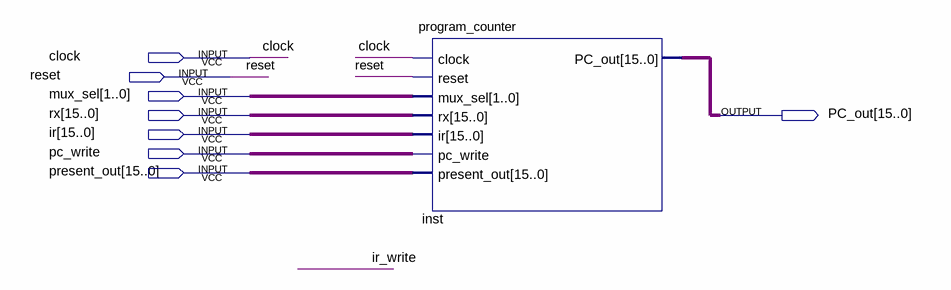
[diagram p0: schematic sheet]
// Quartus schematic program_counter_testbench.bdf as structural Verilog: 1 symbols, 8 pins
module program_counter_testbench (
  input  clock,
  input  reset,
  input  [1:0] mux_sel,
  input  [15:0] rx,
  input  [15:0] ir,
  input  pc_write,
  input  [15:0] present_out,
  output [15:0] PC_out
);

  program_counter inst (
    .clock(clock), .reset(reset), .mux_sel(mux_sel), .rx(rx), .ir(ir), .pc_write(pc_write),
    .present_out(present_out), .PC_out(PC_out));
endmodule
